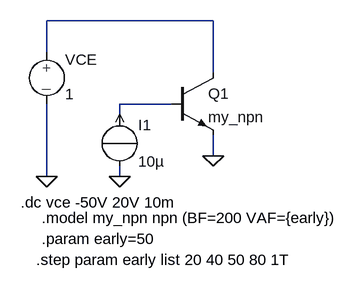
[diagram p0: schematic q1-ausgangskennlinie-early.asc]
q1-ausgangskennlinie-early.asc, the LTspice schematic file:
Version 4
SHEET 1 880 680
WIRE 272 32 16 32
WIRE 16 80 16 32
WIRE 272 112 272 32
WIRE 208 160 128 160
WIRE 128 176 128 160
WIRE 272 240 272 208
WIRE 16 272 16 160
WIRE 128 272 128 256
FLAG 272 240 0
FLAG 128 272 0
FLAG 16 272 0
SYMBOL EIT_Semiconductors\\npn 208 112 R0
SYMATTR InstName Q1
SYMATTR Value my_npn
SYMBOL source-I 128 176 R0
SYMATTR InstName I1
SYMATTR Value 10µ
SYMBOL source-V 16 64 R0
SYMATTR InstName VCE
SYMATTR Value 1
TEXT -24 312 Left 2 !.dc vce -50V 20V 10m
TEXT 8 336 Left 2 !.model my_npn npn (BF=200 VAF={early})
TEXT 8 368 Left 2 !.param early=50
TEXT 0 400 Left 2 !.step param early list 20 40 50 80 1T

The netlist it stands for:
* q1-ausgangskennlinie-early.asc
Q1 N001 N002 0 0 my_npn
I1 0 N002 10µ
VCE N001 0 1
.model NPN NPN
.model PNP PNP
.lib standard.bjt
.dc vce -50V 20V 10m
.model my_npn npn (BF=200 VAF={early})
.param early=50
.step param early list 20 40 50 80 1T
.backanno
.end